# EAGLE design logo (EAGLE 7.4.0)
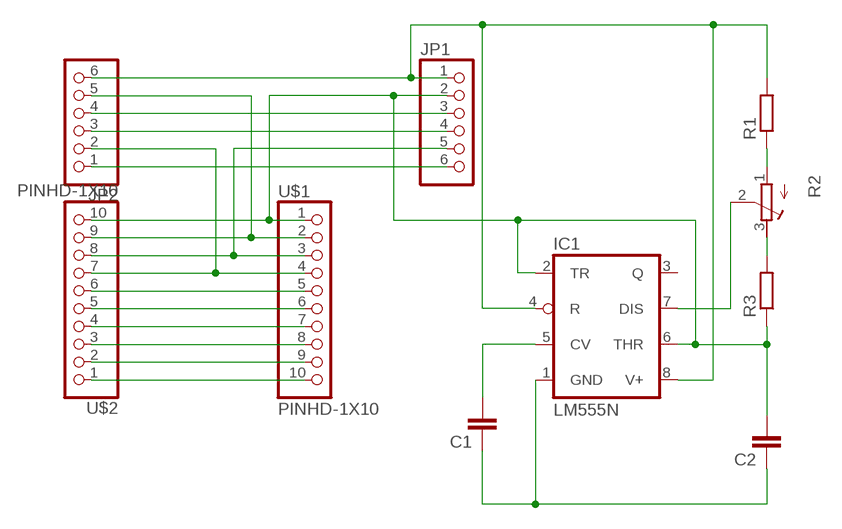
[diagram p0: schematic, sheet 1]

## Parts
C1  C-EU050-025X075  [C050-025X075]
C2  C-EU050-025X075  [C050-025X075]
IC1  LM555N  [DIL08-ROUND]
JP1  PINHD-1X6B  [1X06-BIG]
JP2  PINHD-1X6B  [1X06-BIG]
R1  R-EU_0204/7  [0204/7]
R2  R-TRIMM64W  [RTRIM64W]
R3  R-EU_0204/7  [0204/7]
U$1  PINHD-1X10  [1X10-BIG]
U$2  PINHD-1X10  [1X10-BIG]

## Nets
N$1: U$1.10 U$2.1
N$2: U$1.9 U$2.2
N$3: U$1.8 U$2.3
N$4: U$1.7 U$2.4
N$5: U$1.6 U$2.5
N$6: U$1.5 U$2.6
N$7: JP2.2 U$1.4 U$2.7
N$8: JP1.5 U$1.3 U$2.8
N$9: JP2.5 U$1.2 U$2.9
N$10: C2.2 IC1.2(TR) IC1.6(THR) JP1.2 R3.1 U$1.1 U$2.10
N$12: JP1.3 JP2.4
N$13: JP1.4 JP2.3
N$14: JP1.6 JP2.1
N$15: IC1.4(R) IC1.8(V+) JP1.1 JP2.6 R1.2
N$16: IC1.7(DIS) R2.2(S)
N$17: R1.1 R2.1(A)
N$18: R2.3(E) R3.2
N$19: C1.1 C2.1 IC1.1(GND)
N$20: C1.2 IC1.5(CV)
Unconnected: IC1.3(Q)

## Library data of the parts
C1 C2 = rcl:C-EU: CAPACITOR, European symbol
IC1 = adafruit:*555: TIMER Changed DIP package to have round (not oval) pin pads http://www.ladyada.net/library/pcb/eaglelibrary.html
JP1 JP2 = adafruit:PINHD-1X6: PIN HEADER
R1 R3 = rcl:R-EU_: RESISTOR, European symbol
R2 = rcl:R-TRIMM: Trimm resistor
U$1 U$2 = adafruit:PINHD-1X10: Pin header 1x10 0.1" spacing With round pins

## Board
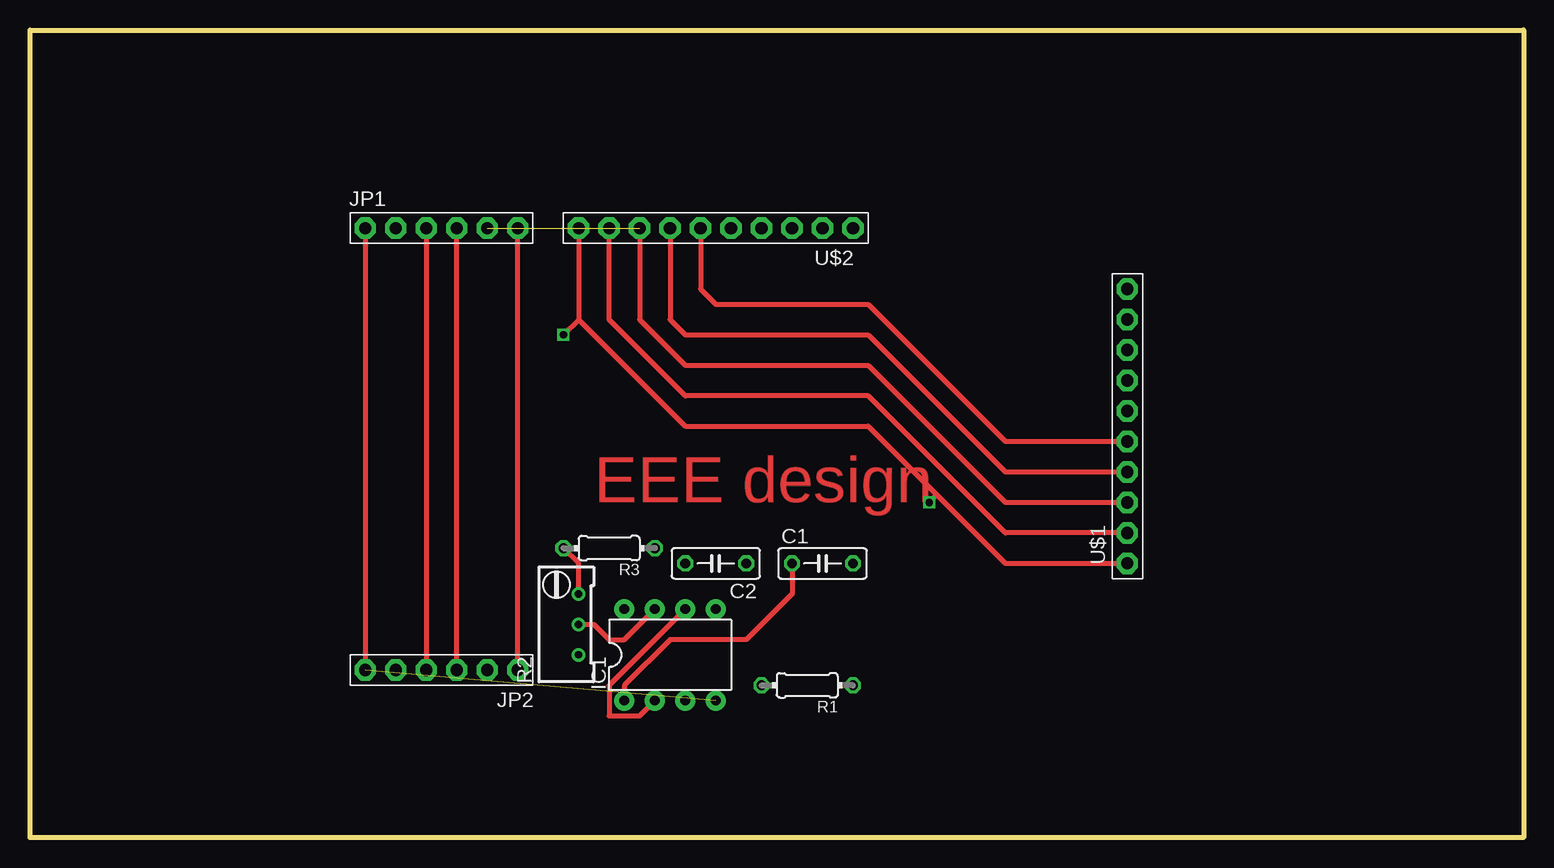
[diagram p1: board, top side]
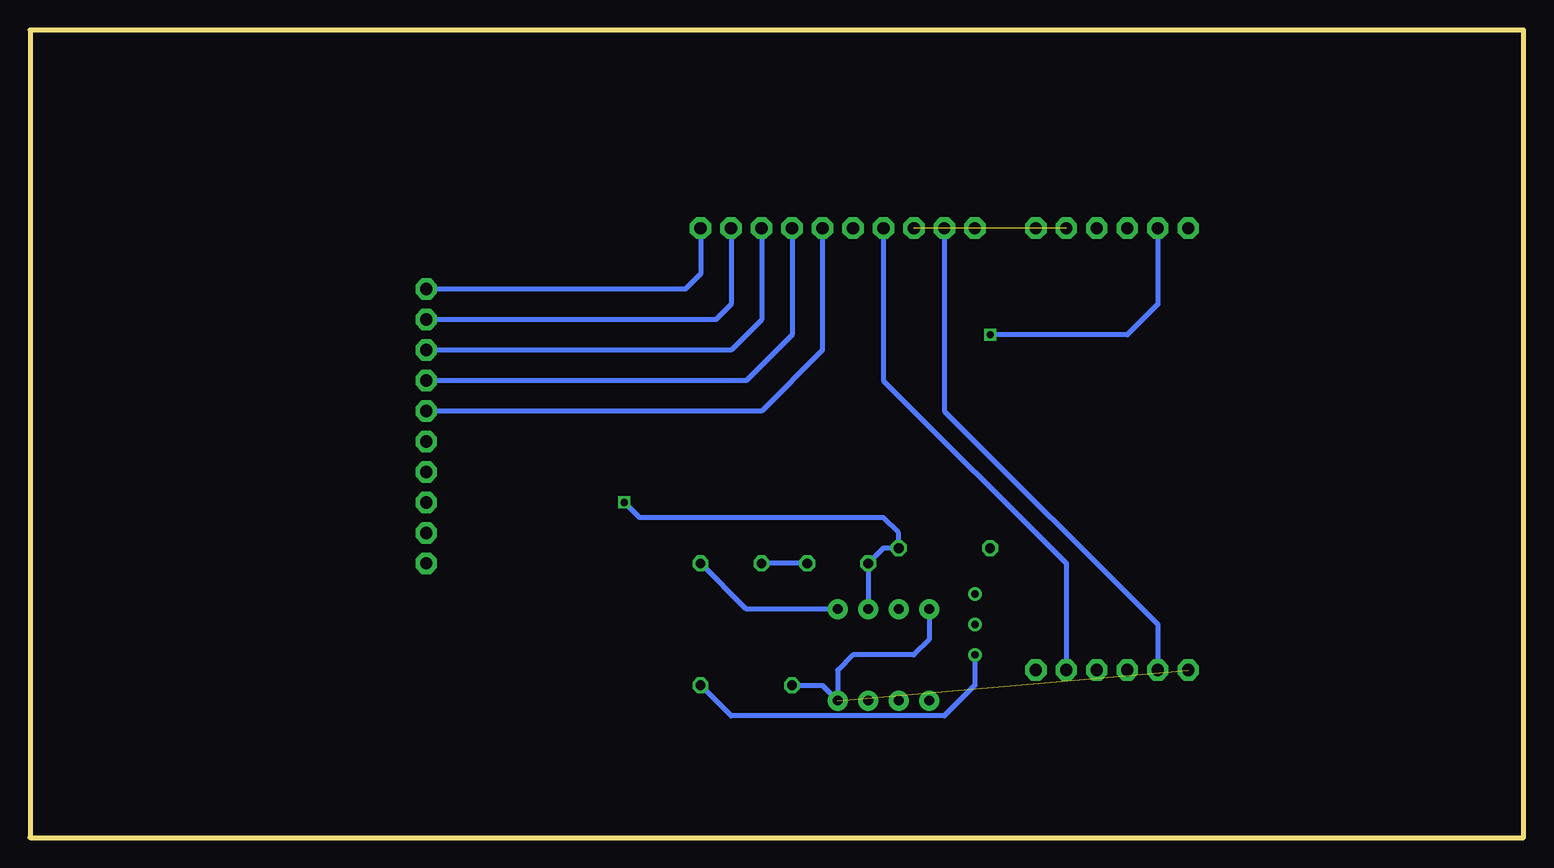
[diagram p2: board, bottom side, seen from below]

Size 124.46 x 67.31 mm. Coordinates in mm from the lower left corner, seen from the top.
Outline: 0,0 0,67.31 124.46,67.31 124.46,0 0,0
Copper layers (1*16): Top 0.035mm / dielectric 1.5mm / Bottom 0.035mm
Design rules "default": minimum track width 10mil, minimum drill 24mil, track to track 8mil, track to pad 8mil, pad to pad 8mil, via to via 8mil, smd to smd 8mil, copper to edge 40mil, drill to drill 8mil, minimum pad ring 10mil, minimum via ring 8mil, stop-mask expansion 4mil, vias tented up to drill 0mil, thermal gap 10mil

### Footprints (pad centres in the part's own frame; a part is rotated, then mirrored left to right if it is on the bottom)
C050-025X075 = drill 0.813 octagon: 1 -2.54,0; 2 2.54,0
DIL08-ROUND = drill 0.813 pad 1.676: 1 -3.81,-3.81; 2 -1.27,-3.81; 3 1.27,-3.81; 4 3.81,-3.81; 5 3.81,3.81; 6 1.27,3.81; 7 -1.27,3.81; 8 -3.81,3.81
1X06-BIG = drill 1.016 pad 1.778 octagon: 1 -6.35,0; 2 -3.81,0; 3 -1.27,0; 4 1.27,0; 5 3.81,0; 6 6.35,0
0204/7 = drill 0.813 octagon: 1 -3.81,0; 2 3.81,0
RTRIM64W = drill 0.61: 1 1.27,-2.54; 2 1.27,0; 3 1.27,2.54
1X10-BIG = drill 1.016 pad 1.778 octagon: 1 -11.43,0; 2 -8.89,0; 3 -6.35,0; 4 -3.81,0; 5 -1.27,0; 6 1.27,0; 7 3.81,0; 8 6.35,0; 9 8.89,0; 10 11.43,0

### Placement (x,y rotation side)
C1  66.04,22.86 0 top
C2  57.15,22.86 180 top
IC1  53.34,15.24 0 top
JP1  34.29,50.8 0 top
JP2  34.29,13.97 180 top
R1  64.77,12.7 180 top
R2  44.45,17.78 0 top
R3  48.26,24.13 180 top
U$1  91.44,34.29 90 top
U$2  57.15,50.8 180 top

### Tracks (layer width: path | path; a pad name or v marks a point on that pad's centre or on a via)
N$1
  Bottom 0.406: U$2.1 68.58,46.99 69.85,45.72 U$1.10
N$2
  Bottom 0.406: U$2.2 66.04,44.45 67.31,43.18 U$1.9
N$3
  Bottom 0.406: U$2.3 63.5,43.18 66.04,40.64 U$1.8
N$4
  Bottom 0.406: U$2.4 60.96,41.91 64.77,38.1 U$1.7
N$5
  Bottom 0.406: U$2.5 58.42,40.64 63.5,35.56 U$1.6
N$6
  Top 0.406: U$2.6 55.88,45.72 57.15,44.45 69.85,44.45 81.28,33.02 U$1.5
N$7
  Top 0.406: U$2.7 53.34,43.18 54.61,41.91 69.85,41.91 81.28,30.48 U$1.4
  Bottom 0.406: U$2.7 53.34,38.1 38.1,22.86 JP2.2
N$8  (1 unrouted)
  Top 0.406: U$2.8 50.8,43.18 54.61,39.37 69.85,39.37 81.28,27.94 U$1.3
N$9
  Top 0.406: U$1.2 81.28,25.4 69.85,36.83 54.61,36.83 48.26,43.18 U$2.9
  Bottom 0.406: U$2.9 48.26,35.56 30.48,17.78 JP2.5
N$10  (via drill 0.6)
  Top 0.406: U$2.10 45.72,43.18 | 45.72,43.18 54.61,34.29 69.85,34.29 75.56,28.57 | 75.56,28.57 81.28,22.86 U$1.1 | v44.45,41.91 45.72,43.18 | v74.93,27.94 75.56,28.57 | IC1.6 48.26,12.7 48.26,10.16 50.8,10.16 IC1.2
  Bottom 0.406: JP1.2 30.48,44.45 33.02,41.91 v44.45,41.91 | v74.93,27.94 73.66,26.67 53.34,26.67 52.07,25.4 R3.1 53.34,24.13 C2.2 IC1.6
N$12
  Top 0.406: JP1.3 JP2.4
N$13
  Top 0.406: JP2.3 JP1.4
N$14
  Top 0.406: JP2.1 JP1.6
N$15  (1 unrouted)
  Top 0.406: JP1.1 JP2.6
  Bottom 0.406: IC1.8 49.53,16.51 50.8,15.24 55.88,15.24 57.15,13.97 IC1.4 58.42,12.7 R1.2
N$16
  Top 0.406: R2.2 46.99,17.78 48.26,16.51 49.53,16.51 IC1.7
N$17
  Bottom 0.406: R2.1 45.72,12.7 48.26,10.16 66.04,10.16 R1.1
N$18
  Top 0.406: R2.3 45.72,22.86 R3.2
N$19
  Top 0.406: C1.1 63.5,20.32 59.69,16.51 53.34,16.51 49.53,12.7 IC1.1
  Bottom 0.406: C2.1 C1.1
N$20
  Bottom 0.406: IC1.5 64.77,19.05 C1.2

### Text on the board
Top: EEE design